# EAGLE design Tractive System Active Light rev3 (EAGLE 9.6.2)
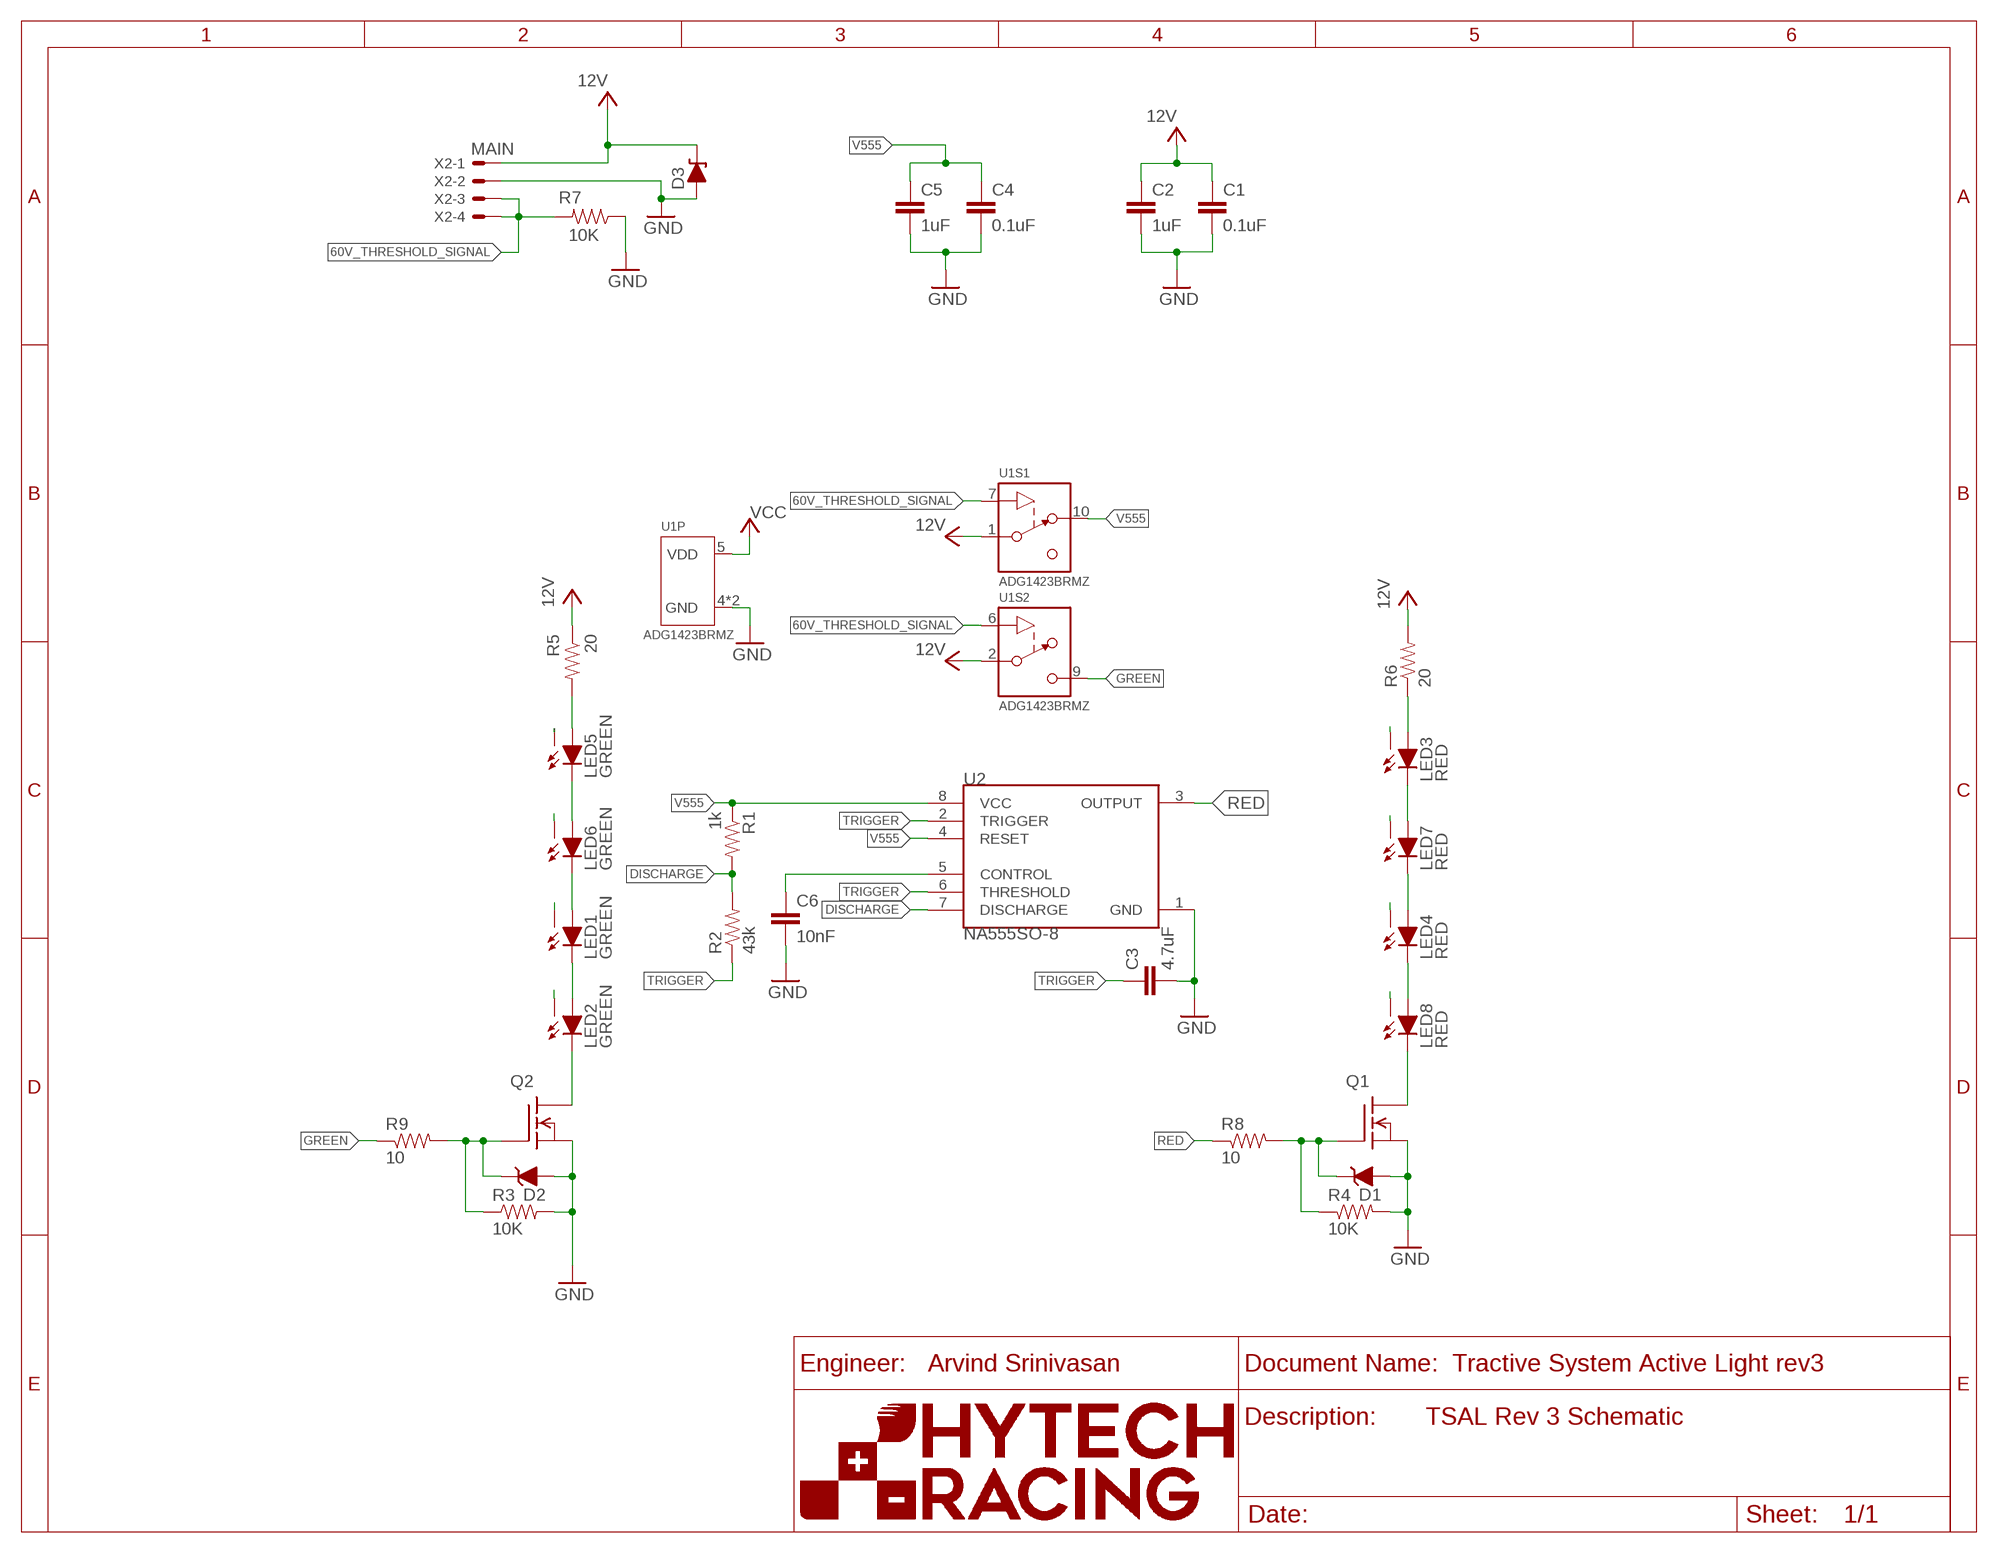
[diagram p0: schematic, sheet 1]
U$1 (FRAME_A_L): ORIENTATION: LANDSCAPE; SIZE: A

## Parts
C1  0.1uF  CAP0603-CAP  [0603-CAP]
C2  1uF  CAP0603-CAP  [0603-CAP]
C3  4.7uF  CAP0603-CAP  [0603-CAP]
C4  0.1uF  CAP0603-CAP  [0603-CAP]
C5  1uF  CAP0603-CAP  [0603-CAP]
C6  10nF  CAP0603-CAP  [0603-CAP]
D1  MMBZ5246BLT1G  DIODE_ZENER  [SOT23]
D2  MMBZ5246BLT1G  DIODE_ZENER  [SOT23]
D3  D15V0S1U2LP1608  TVS_DIODE  [U-DFN1608-2]
LED1  GREEN  XP-E2XP-E2  [XP-E2]
LED2  GREEN  XP-E2XP-E2  [XP-E2]
LED3  RED  XP-E2XP-E2  [XP-E2]
LED4  RED  XP-E2XP-E2  [XP-E2]
LED5  GREEN  XP-E2XP-E2  [XP-E2]
LED6  GREEN  XP-E2XP-E2  [XP-E2]
LED7  RED  XP-E2XP-E2  [XP-E2]
LED8  RED  XP-E2XP-E2  [XP-E2]
Q1  DMG3406LSOT  [SOT23]
Q2  DMG3406LSOT  [SOT23]
R1  1k  RESISTOR0603-RES  [0603-RES]
R2  43k  RESISTOR0603-RES  [0603-RES]
R3  10K  RESISTOR0603-RES  [0603-RES]
R4  10K  RESISTOR0603-RES  [0603-RES]
R5  20  RESISTOR0603-RES  [0603-RES]
R6  20  RESISTOR0603-RES  [0603-RES]
R7  10K  RESISTOR0603-RES  [0603-RES]
R8  10  RESISTOR0603-RES  [0603-RES]
R9  10  RESISTOR0603-RES  [0603-RES]
U1  ADG1423  [MSOP-10]
U2  NA555SO-8  [SOIC-08]
X2  MAIN  CONNECTOR-4NANO-FIT_RIGHT_ANGLE-4-SURFACE  [NANO-FIT_RIGHT_ANGLE-4-SURFACE]

## Nets
60V_THRESHOLD_SIGNAL: R7.2 U1.6(S2:IN) U1.7(S1:IN) X2.3 X2.4
DISCHARGE: R1.2 R2.2 U2.7(DISCHARGE)
GND: C1.2 C2.2 C3.2 C4.2 C5.2 C6.2 D1.1(A) D2.1(A) D3.P$1(A) Q1.2(S) Q2.2(S) R3.2 R4.2 R7.1 U1.4(P:GND) U1.8(P:GND) U2.1(GND) X2.2
GREEN: R9.1 U1.9(S2:D)
N$1: LED1.A LED6.C
N$2: LED2.C Q2.3(D)
N$3: LED5.C LED6.A
N$4: D1.3(C) Q1.1(G) R4.1 R8.2
N$5: LED5.A R5.2
N$6: D2.3(C) Q2.1(G) R3.1 R9.2
N$10: LED8.C Q1.3(D)
N$11: LED3.A R6.1
N$13: C6.1 U2.5(CONTROL)
N$16: LED1.C LED2.A
N$17: LED3.C LED7.A
N$18: LED4.A LED7.C
N$19: LED4.C LED8.A
RED: R8.1 U2.3(OUTPUT)
THERM: LED1.X LED2.X LED3.X LED4.X LED5.X LED6.X LED7.X LED8.X
TRIGGER: C3.1 R2.1 U2.2(TRIGGER) U2.6(THRESHOLD)
V555: C4.1 C5.1 R1.1 U1.10(S1:D) U2.4(RESET) U2.8(VCC)
VCC: C1.1 C2.1 D3.P$2(C) R5.1 R6.2 U1.1(S1:S) U1.2(S2:S) U1.5(P:VDD) X2.1 ; supply symbol labelled 12V

## Notes on the sheet
- Arvind Srinivasan
- TSAL Rev 3 Schematic

## Library data of the parts
C1-C6 = HyTechDevices:CAP: Capacitor Standard 0603 ceramic capacitor, and 0.1" leaded capacitor.; TOLERANCE: 5%; VOLTAGE: 25V
D1 D2 = HyTechDevices:DIODE_ZENER: ZENER DIODE
D3 = HyTechDevices:TVS_DIODE
LED1-LED8 = HyTechDevices:XP-E2: XP-E2 high-brightness LED. Data sheet <https://www.cree.com/led-components/media/documents/XLampXPE2.pdf>
Q1 Q2 = HyTechDevices:DMG3406L: Generic NPN MOSFET DMG3406L (SOT-23, 2.8 A 30V)
R1-R9 = HyTechDevices:RESISTOR: Resistor Basic schematic elements and footprints for 0603, 1206, and PTH resistors.; TOLERANCE: 1%
U1 = HyTechDevices:ADG1423: ADG1423 Form-A/Form-C Analog Switch Datasheet <https://www.mouser.com/datasheet/2/609/ADG1421_1422_1423-1502752.pdf>; DKPN: ADG1423BRMZ-REEL7CT-ND; MANUFACTURER: Analog Devices Inc.; MOPN: 584-ADG1423BRMZ; MPN: ADG1423BRMZ
U2 = HyTechDevices:NA555: Texas Instruments NA555 timer. Data sheet <http://www.ti.com/lit/ds/symlink/se555.pdf>
X2 = HyTechDevices:CONNECTOR-4: Mini-Fit Junior connector 4 pole Source: http://www.molex.com

## Board
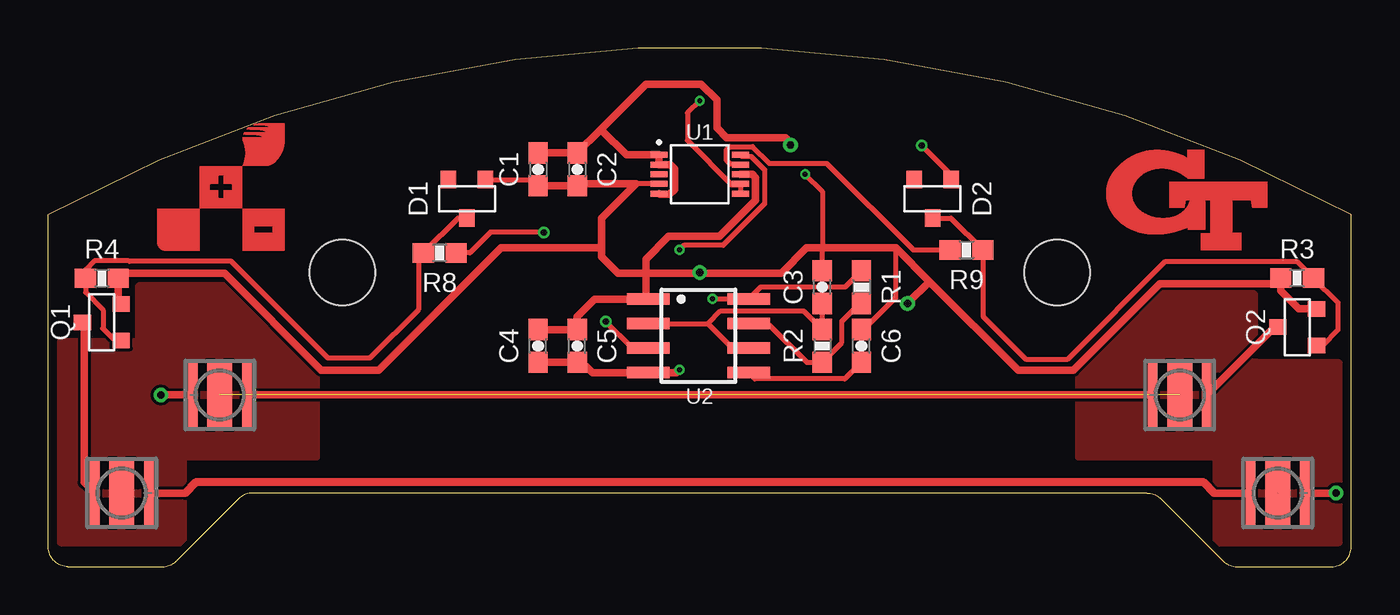
[diagram p1: board, top side]
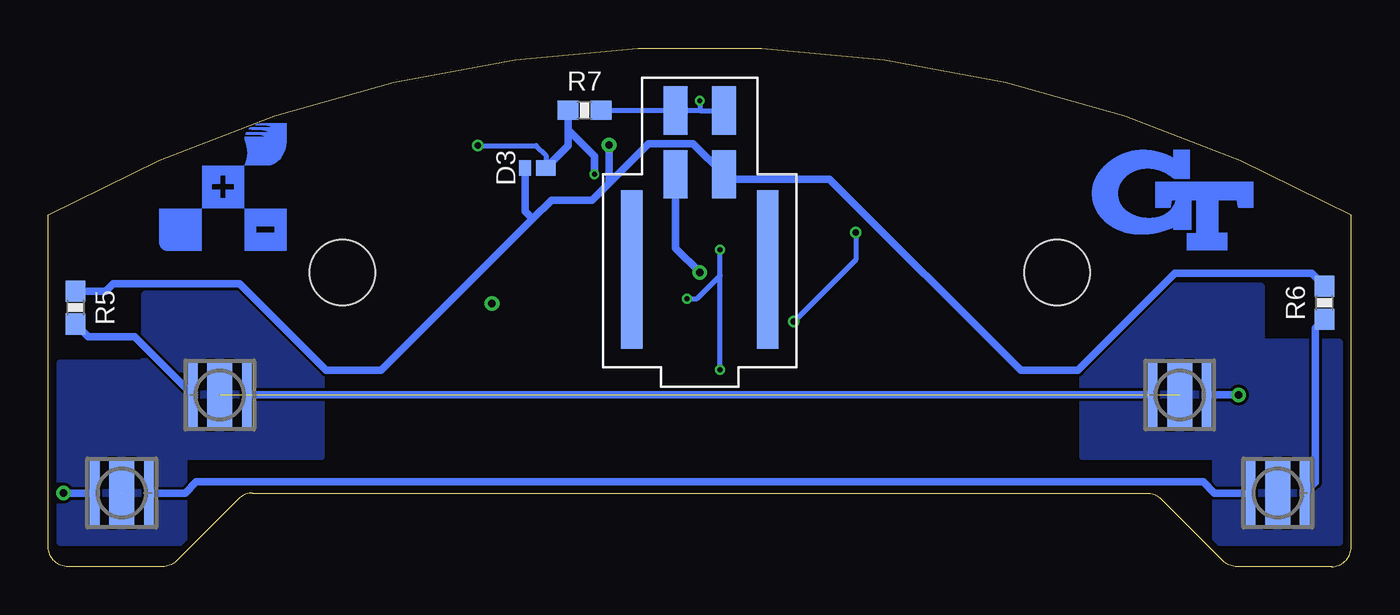
[diagram p2: board, bottom side, seen from below]

Size 67.51 x 26.85 mm. Coordinates in mm from the lower left corner, seen from the top.
Outline: 57.65,3.51 60.87,0.3 arc45 61.58,0 66.5,0 arc90 67.51,1.02 67.51,18.22 arc58 0,18.22 0,1.02 arc90 1.02,0 5.93,0 arc45 6.65,0.3 9.86,3.51 arc-45 10.58,3.81 56.93,3.81 arc-45 57.65,3.51
Copper layers (1*16): Top 0.035559375mm / dielectric 1.6mm / Bottom 0.035559375mm
Design rules "OshPark (2 Layer)": minimum track width 6mil, minimum drill 10mil, track to track 6mil, track to pad 6mil, pad to pad 6mil, via to via 6mil, smd to smd 6mil, copper to edge 15mil, drill to drill 6mil, minimum pad ring 5mil, minimum via ring 5mil, stop-mask expansion 2.5mil, vias tented up to drill 30mil, thermal gap 10mil

### Footprints (pad centres in the part's own frame; a part is rotated, then mirrored left to right if it is on the bottom)
M3_MOUNTING = hole 3.4: 0,0
0603-CAP = smd 1.1 x 1: 1 -0.85,0; 2 0.85,0
SOT23 = smd 0.8 x 0.9: 1 -0.95,-1; 2 0.95,-1; 3 0,1
U-DFN1608-2 = smd 0.8 x 1.011: P$1 0,0 | smd 0.8 x 0.61: P$2 0,-1.092
XP-E2 = smd 0.5 x 3.3: A -1.4,0; C 1.4,0 | smd 1.3 x 3.3: X 0,0
0603-RES = smd 1.1 x 1: 1 -0.85,0; 2 0.85,0
MSOP-10 = smd 0.305 x 0.889: 1 -1,-2.106; 2 -0.5,-2.106; 3 0,-2.106; 4 0.5,-2.106; 5 1,-2.106; 6 1,2.106; 7 0.5,2.106; 8 0,2.106; 9 -0.5,2.106; 10 -1,2.106
SOIC-08 = smd 0.6 x 2.2: 1 -1.905,-2.6; 2 -0.635,-2.6; 3 0.635,-2.6; 4 1.905,-2.6; 5 1.905,2.6; 6 0.635,2.6; 7 -0.635,2.6; 8 -1.905,2.6
NANO-FIT_RIGHT_ANGLE-4-SURFACE = smd 1.24 x 2.5: 1 1.25,0; 2 -1.25,0; 3 1.25,3.3; 4 -1.25,3.3 | smd 1.1 x 8.2: P$5 -3.52,-4.93; P$6 3.52,-4.93

### Placement (x,y rotation side)
$$U$1  [M3_MOUNTING]  15.24,15.24 0 top
C1  25.37,20.57 270 top
C2  27.41,20.57 270 top
C3  40.11,14.48 90 top
C4  25.37,11.43 90 top
C5  27.41,11.43 90 top
C6  42.14,11.43 90 top
D1  21.69,19.05 180 top
D2  45.82,19.05 180 top
D3  41.72,20.66 270 bottom
LED1  8.89,8.89 0 top
LED2  58.62,8.89 0 top
LED3  3.81,3.81 180 bottom
LED4  63.7,3.81 180 top
LED5  58.62,8.89 0 bottom
LED6  8.89,8.89 0 bottom
LED7  63.7,3.81 180 bottom
LED8  3.81,3.81 180 top
Q1  2.78,12.65 90 top
Q2  64.71,12.4 90 top
R1  42.14,14.48 270 top
R2  40.11,11.43 270 top
R3  64.71,14.94 180 top
R4  2.78,14.94 0 top
R5  66.11,13.42 270 bottom
R6  1.38,13.67 90 bottom
R7  39.73,23.63 0 bottom
R8  20.28,16.25 180 top
R9  47.58,16.4 0 top
U1  33.76,20.32 270 top
U2  33.69,11.95 270 top
U$2  [M3_MOUNTING]  52.27,15.24 0 top
X2  33.76,20.32 0 bottom

### Tracks (layer width: path | path; a pad name or v marks a point on that pad's centre or on a via)
60V_THRESHOLD_SIGNAL  (via drill 0.25 pad 0.51)
  Top 0.254: v33.76,24.13 33.12,23.49 33.12,22.07 35.43,19.76 35.8,19.76 U1.7 U1.6
  Bottom 0.254: v33.76,24.13 33.76,23.62 | 33.76,23.62 X2.4 35.02,23.63 R7.2 | 33.76,23.62 33.75,23.62 X2.3
DISCHARGE
  Top 0.254: R1.2 42.04,13.63 41.12,12.71 41.12,11.6 R2.2 39.31,10.58 37.3,12.59 U2.7
GND  (via drill 0.25 pad 0.51, 0.35, 0.38 pad 0.76)
  Top 0.254: v39.22,20.32 40.11,19.43 40.11,16.51 C3.2 | 43.92,16.51 43.92,13.96 42.24,12.28 C6.2 | D1.1 25.33,20.05 25.66,19.72 | v45.26,21.81 46.77,20.3 D2.1 | U1.4 30.46,19.82
  Top 0.381: 45.66,14.77 50.27,10.16 53.12,10.16 57.6,14.65 63.56,14.65 R3.2 63.86,14.29 64.8,13.35 Q2.2 | 45.66,14.77 43.92,16.51 40.11,16.51 39.3,16.51 37.99,15.2 33.76,15.2 | 28.68,16.51 23.47,16.51 17.13,10.17 14.15,10.17 9.13,15.18 3.83,15.18 3.63,14.98 R4.2 3.63,13.75 Q1.2 | 30.96,15.2 29.53,15.2 28.68,16.05 28.68,16.51 | 30.96,15.2 33.76,15.2 | 33.76,15.2 v33.76,15.24 | 28.68,16.51 28.68,18.03 30.46,19.82 27.5,19.82 C2.2 25.66,19.72 C1.2 | 30.96,15.2 30.96,13.98 U2.1 28.31,13.86 27.41,12.95 C5.2 C4.2 | 45.66,14.77 | 45.66,14.77 v44.52,13.63 | U1.8 36.48,20.32 36.65,20.15 36.65,18.98 34.78,17.11 32.15,17.11 30.96,15.93 30.96,15.2
  Bottom 0.254: X2.2 | v45.26,21.81 42.23,21.81 41.72,21.3 D3.P$1
  Bottom 0.381: X2.2 35.02,16.5 v33.76,15.24 | v39.22,20.32 39.22,21.27 40.58,22.63 | R7.1 40.58,22.63 | D3.P$1 40.58,21.8 40.58,22.63
GREEN
  Top 0.254: R9.1 44.82,16.4 40.33,20.89 37.36,20.89 36.5,21.75 35.3,21.75 35.14,21.59 35.14,21.05 35.34,20.85 35.84,20.85 U1.9
N$1  (via drill 0.38 pad 0.76)
  Top 0.381: v5.84,8.89 LED6.C
  Bottom 0.381: LED6.C v5.84,8.89
N$2
  Top 0.381: LED2.C 63.53,12.4 Q2.3
N$3
  Bottom 0.381: LED6.A LED5.C
N$4
  Top 0.254: D1.3 21.23,18.05 R8.2 19.18,16 19.18,13.32 16.65,10.79 14.49,10.79 9.48,15.81 4.2,15.81 4.18,15.83 2.38,15.83 1.93,15.38 R4.1 1.93,14.2 2.84,13.29 2.84,12.36 2.82,12.34 3.46,11.7 Q1.1
N$5
  Bottom 0.381: R5.2 65.44,11.9 63.04,11.9 LED5.A | LED5.A
N$6
  Top 0.254: D2.3 46.78,18.05 R9.2 48.43,12.96 50.65,10.75 52.83,10.75 57.89,15.81 64.68,15.81 R3.1 66.82,13.68 66.82,12.27 66,11.45 Q2.1
N$10
  Top 0.381: LED8.C 1.86,4.36 1.86,12.57 Q1.3
N$11
  Bottom 0.381: R6.1 1.86,12.34 1.86,4.36 LED3.A
N$13
  Top 0.254: U2.5 36.61,9.72 41.28,9.72 C6.1
N$16
  Top 0.381: LED1.C LED2.A
N$17
  Bottom 0.381: LED7.A 60.43,3.81 59.84,4.39 7.67,4.39 7.09,3.81 LED3.C
N$18  (via drill 0.38 pad 0.76)
  Top 0.381: LED4.A v66.73,3.81
  Bottom 0.381: v66.73,3.81 LED4.A
N$19
  Top 0.381: 60.43,3.81 LED4.C | 7.09,3.81 LED8.A
  Top 0.406: 7.09,3.81 7.67,4.39 59.84,4.39 60.43,3.81
RED  (via drill 0.35)
  Top 0.254: v25.68,17.3 25.65,17.32 22.92,17.32 21.84,16.25 R8.1 | U2.3 30.26,11.32 v28.88,12.7
  Bottom 0.254: v25.68,17.3 25.68,15.9 v28.88,12.7
THERM  (3 unrouted)
  pour Top: 6.98,1.27 6.98,11.61 0.63,11.61 0.63,1.27
  pour Top: 4.69,5.71 13.88,5.71 13.88,14.52 4.69,14.52
  pour Top: 53.4,14.1 53.4,5.71 62.49,5.71 62.49,14.1
  pour Top: 66.88,1.27 66.88,10.53 60.53,10.53 60.53,1.27
  pour Bottom: 66.88,1.27 66.88,10.53 60.53,10.53 60.53,1.27
  pour Bottom: 62.49,5.71 62.49,14.1 53.4,14.1 53.4,5.71
  pour Bottom: 13.88,5.71 13.88,14.52 4.69,14.52 4.69,5.71
  pour Bottom: 6.98,1.27 6.98,11.61 0.63,11.61 0.63,1.27
TRIGGER
  Top 0.254: C3.1 R2.1 39.14,13.25 34.84,13.25 34.18,12.59 | 34.18,12.59 35.45,11.32 U2.6 | U2.2 34.18,12.59
V555  (via drill 0.25 pad 0.51)
  Top 0.254: 27.87,10.37 27.66,10.58 C5.1 | R1.1 41.3,14.49 36.92,14.49 U2.8 34.43,13.86 v34.41,13.88 | v32.71,16.42 32.93,16.64 34.97,16.64 37.12,18.79 37.12,20.56 36.42,21.25 35.93,21.25 U1.10
  Top 0.381: C5.1 C4.1 | v32.71,10.19 32.56,10.05 U2.4 28.19,10.05 27.87,10.37
  Bottom 0.254: v32.71,10.19 32.71,15.08 | 32.71,15.08 v32.71,16.42 | v34.41,13.88 33.91,13.88 32.71,15.08
VCC  (via drill 0.38 pad 0.76)
  Top 0.381: C1.1 C2.1 28.59,22.61 | v38.46,21.84 38.46,21.97 38.2,22.22 35.15,22.22 34.65,22.73 34.65,24.17 33.83,24.98 30.97,24.98 28.59,22.61 | 28.59,22.61 28.68,22.61 29.96,21.32 U1.1 U1.2 32.23,20.82 32.44,20.62 32.44,19.53 32.19,19.29 31.69,19.29 U1.5
  Bottom 0.381: 42.42,18.01 41.44,18.98 39.34,18.98 38.46,19.86 | 42.42,18.01 50.27,10.16 53.11,10.16 57.6,14.66 64.15,14.66 64.54,14.27 R5.1 | R6.2 2.05,15.18 9.14,15.18 14.15,10.17 17.13,10.17 27.03,20.07 32.25,20.07 X2.1 34.1,21.91 36.41,21.91 38.46,19.86 | v38.46,21.84 38.46,19.86 | D3.P$2 42.81,18.4 42.42,18.01
(copper drawn outside any net)
  shapes: Bottom area x1608, Top area x1608

### Text on the board
tDocu: HyTech Racing 2021 / Tractive System Active Light rev3
bDocu: Designed by / Jason Yang, / Arvind Srinivasan, / Cody Kaminsky | HyTech Racing 2021 / Tractive System Active Light rev3